# Altium schematic sheet 04_Mechanicals.SchDoc
size A; ApprovedDate: 04/02/2019; AssemblyNumber: ECE315-F19
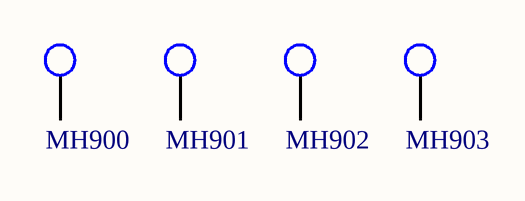
[diagram p0: 04_Mechanicals.SchDoc]

## Parts
MH900  MHOLE_2_55MM  [MHOLE_2_55MM]  (value not drawn)  (no BOM)
MH901  MHOLE_2_55MM  [MHOLE_2_55MM]  (value not drawn)  (no BOM)
MH902  MHOLE_2_55MM  [MHOLE_2_55MM]  (value not drawn)  (no BOM)
MH903  MHOLE_2_55MM  [MHOLE_2_55MM]  (value not drawn)  (no BOM)

## Nets

Not connected (* = marked no-connect by the designer): MH900 1; MH901 1; MH902 1; MH903 1

## Library data of the parts
MH900-MH903 = MHOLE_2_55MM: Mounting Holde; Manufacturer Part Number: UW MTHOLE